# Altium project MPPT.PrjPcb
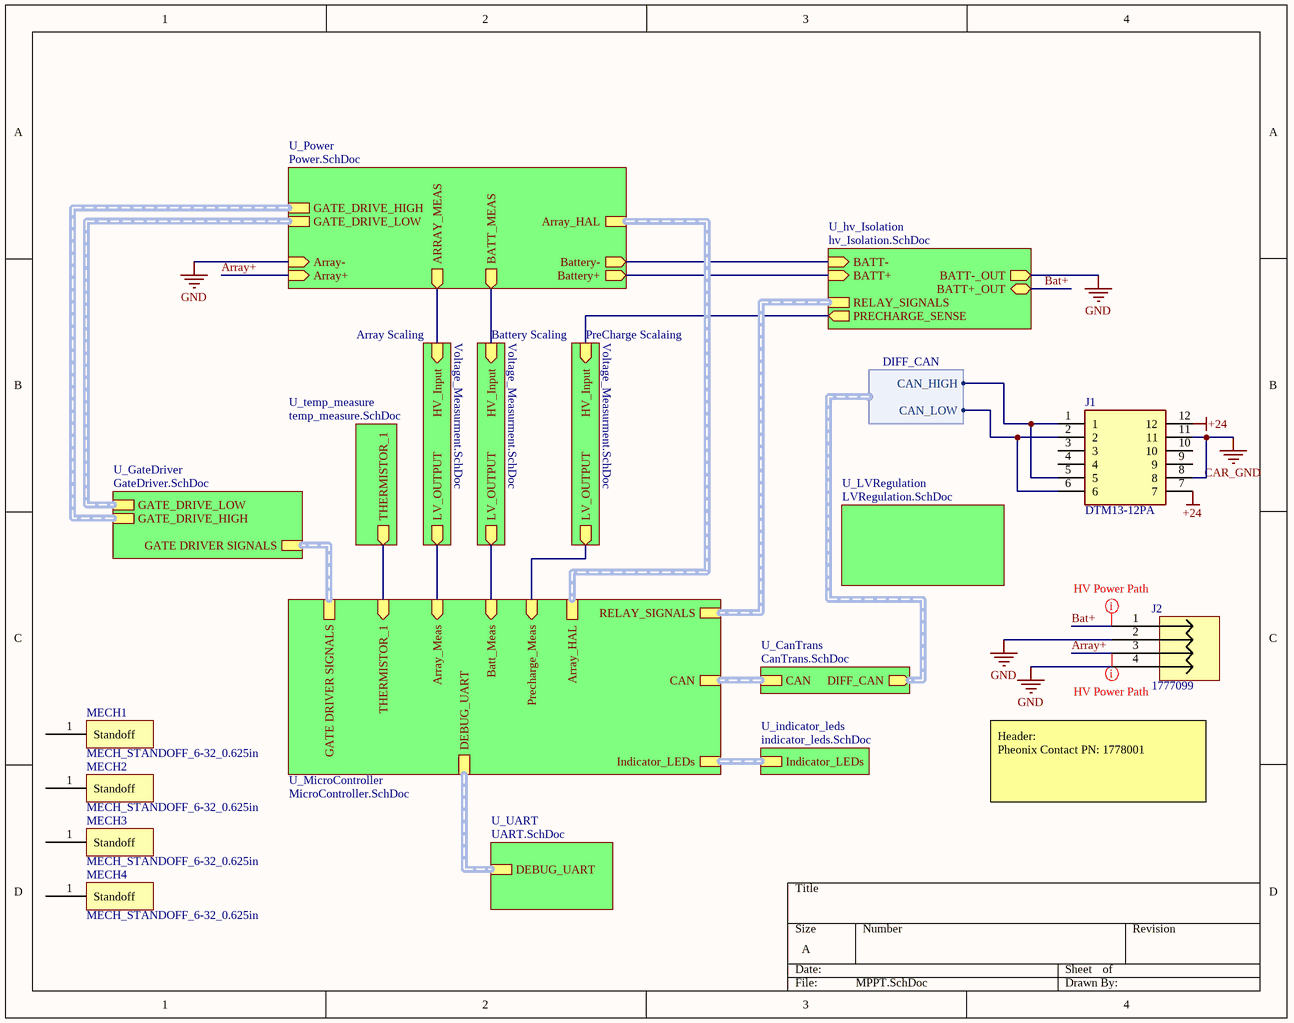
[diagram p0: MPPT.SchDoc]
12 sheets, 128 parts. Net scope: hierarchical (ports join the sheet entries above them; power ports are global).
Board file: MPPT.PcbDoc
Sheets:
  MPPT.SchDoc
    U_GateDriver = GateDriver.SchDoc
    U_Power = Power.SchDoc
    U_MicroController = MicroController.SchDoc
      U_JTAG = JTAG.SchDoc
    U_CanTrans = CanTrans.SchDoc
    Array Scaling = Voltage_Measurment.SchDoc
    Battery Scaling = Voltage_Measurment.SchDoc
    U_LVRegulation = LVRegulation.SchDoc
    U_hv_Isolation = hv_Isolation.SchDoc
    U_indicator_leds = indicator_leds.SchDoc
    U_temp_measure = temp_measure.SchDoc
    PreCharge Scalaing = Voltage_Measurment.SchDoc
    U_UART = UART.SchDoc

## Sheet MPPT.SchDoc
size A; SheetNumber: 1; SheetTotal: 12

### Parts
J1  DTM13-12PA  [TE_DTM13-12PA]
J2  1777099  [FP-1777099-MFG]
MECH1  MECH_STANDOFF_6-32_0.625in  [STANDOFF_6-32_0.625in]
MECH2  MECH_STANDOFF_6-32_0.625in  [STANDOFF_6-32_0.625in]
MECH3  MECH_STANDOFF_6-32_0.625in  [STANDOFF_6-32_0.625in]
MECH4  MECH_STANDOFF_6-32_0.625in  [STANDOFF_6-32_0.625in]

### Sub-sheets
Array Scaling = Voltage_Measurment.SchDoc: LV_OUTPUT (out), HV_Input (in)
Battery Scaling = Voltage_Measurment.SchDoc: LV_OUTPUT (out), HV_Input (in)
PreCharge Scalaing = Voltage_Measurment.SchDoc: LV_OUTPUT (out), HV_Input (in)
U_CanTrans = CanTrans.SchDoc: CAN (harness CAN), DIFF_CAN (out, harness DIFF_CAN)
U_GateDriver = GateDriver.SchDoc: GATE DRIVER SIGNALS (harness Gate Driver), GATE_DRIVE_HIGH (harness GATE_DRIVE), GATE_DRIVE_LOW (harness GATE_DRIVE)
U_hv_Isolation = hv_Isolation.SchDoc: BATT+_OUT (bidir), BATT-_OUT (out), BATT+ (in), BATT- (in), RELAY_SIGNALS, PRECHARGE_SENSE (out)
U_indicator_leds = indicator_leds.SchDoc: Indicator_LEDs (harness Indicator LEDs)
U_LVRegulation = LVRegulation.SchDoc: no entries
U_MicroController = MicroController.SchDoc: CAN (harness CAN), Batt_Meas (in), Array_Meas (in), GATE DRIVER SIGNALS (harness Gate Driver), RELAY_SIGNALS (harness RELAY SIGNALS), Indicator_LEDs, THERMISTOR_1 (in), Array_HAL, Precharge_Meas (in), DEBUG_UART (harness DEBUG_UART)
U_Power = Power.SchDoc: Array- (in), Array+ (in), Battery+ (out), Battery- (out), GATE_DRIVE_HIGH, GATE_DRIVE_LOW, BATT_MEAS (out), ARRAY_MEAS (out), Array_HAL (harness HAL_OUTPUT)
U_temp_measure = temp_measure.SchDoc: THERMISTOR_1 (out)
U_UART = UART.SchDoc: DEBUG_UART

### Harnesses
DIFF_CAN: CAN_HIGH, CAN_LOW

### Nets
+24: J1.7 J1.12
CAR_GND: J1.8 J1.11
GND: J2.2 J2.4 ; sheet U_Power/Array-, sheet U_Power/Battery-, sheet U_hv_Isolation/BATT-_OUT, sheet U_hv_Isolation/BATT-
Array+: J2.3 ; sheet U_Power/Array+
Array_Measure: sheet U_Power/ARRAY_MEAS, sheet Array Scaling/HV_Input
Bat+: J2.1 ; sheet U_hv_Isolation/BATT+_OUT
boost_output: sheet U_Power/BATT_MEAS, sheet Battery Scaling/HV_Input
CAN_N: J1.2 J1.6 ; sheet U_CanTrans/DIFF_CAN.CAN_LOW
CAN_P: J1.1 J1.5 ; sheet U_CanTrans/DIFF_CAN.CAN_HIGH
NetC35A_2: sheet U_MicroController/Array_Meas, sheet Array Scaling/LV_OUTPUT
NetC35B_2: sheet U_MicroController/Batt_Meas, sheet Battery Scaling/LV_OUTPUT
NetC35C_2: sheet U_MicroController/Precharge_Meas, sheet PreCharge Scalaing/LV_OUTPUT
NetF1_2: sheet U_Power/Battery+, sheet U_hv_Isolation/BATT+
NetJ4_2: sheet U_MicroController/THERMISTOR_1, sheet U_temp_measure/THERMISTOR_1
NetK1_4: sheet U_hv_Isolation/PRECHARGE_SENSE, sheet PreCharge Scalaing/HV_Input

Not connected (* = marked no-connect by the designer): J1 3 4 9 10; MECH1 1(Standoff); MECH2 1(Standoff); MECH3 1(Standoff); MECH4 1(Standoff)

### Buses and harness runs
harness sheet U_CanTrans/CAN = sheet U_MicroController/CAN
harness sheet U_GateDriver/GATE DRIVER SIGNALS = sheet U_MicroController/GATE DRIVER SIGNALS
harness sheet U_GateDriver/GATE_DRIVE_HIGH = sheet U_Power/GATE_DRIVE_HIGH
harness sheet U_GateDriver/GATE_DRIVE_LOW = sheet U_Power/GATE_DRIVE_LOW
harness sheet U_hv_Isolation/RELAY_SIGNALS = sheet U_MicroController/RELAY_SIGNALS
harness sheet U_indicator_leds/Indicator_LEDs = sheet U_MicroController/Indicator_LEDs
harness sheet U_MicroController/Array_HAL = sheet U_Power/Array_HAL
harness sheet U_MicroController/DEBUG_UART = sheet U_UART/DEBUG_UART

### Layout directives
net class High Current; net class HV: Array+, Bat+

### Notes on the sheet
- Header:
  Pheonix Contact PN: 1778001

### Library data of the parts
J1 = CMP-183-000000-3: 12 way DTM13 A key Receptacle with PCB mount and 90 degree molded pins. Sealable, with centerline pitch .165 inch/4 millimeters. Gray.; Gender: Male; Voltage Rating: 250V; Connector Type: COMBINATION LINE CONNECTOR; Max Current Rating: 11A; Mounting Technology: TH; Case/Package: 12-DIP; Pins: 12; RoHS Compliant: Yes
J2 = CMP-002-00150-1: Strip Terminal Block, 12A, 1 Row(s), 1 Deck(s); Connector Type: Through Hole; Voltage Rating: 320V; Gender: Male; Current Rating: 12A; Mounting Technology: Board; RoHS Compliant: Yes; Pins: 4; Case/Package: 4-SIP
MECH1-MECH4 = CMP-044-000005-2: Hex Standoff Threaded #6-32 Aluminum 0.625" (15.88mm) 5/8"; Design Item ID: MECH_STANDOFF_6-32_0.625in; Source: mech.SchLib

## Sheet GateDriver.SchDoc
size A; SheetNumber: 2; SheetTotal: 12
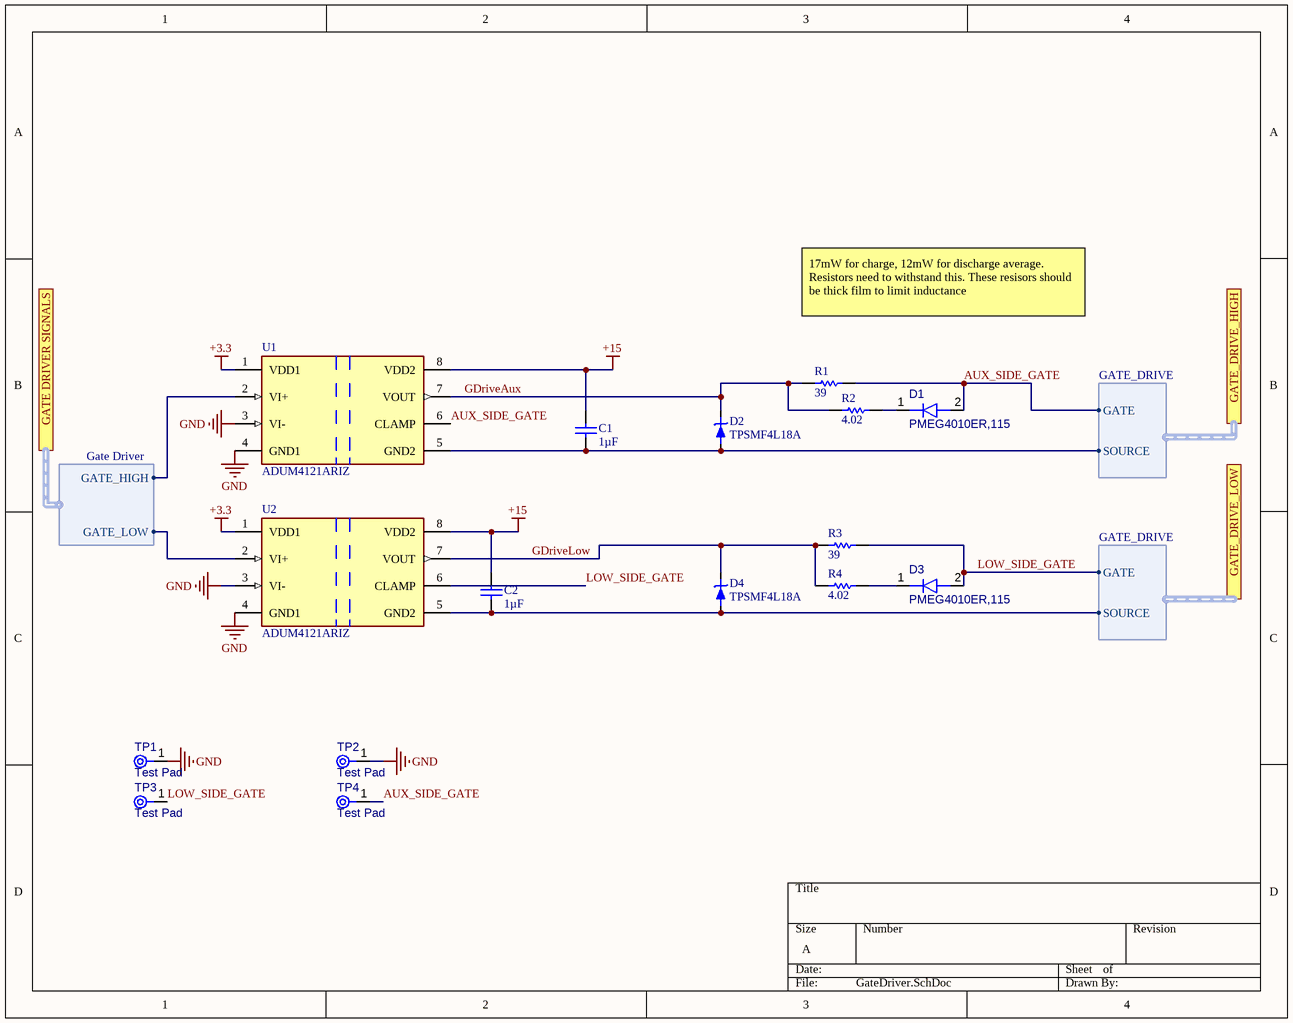
[diagram p1: GateDriver.SchDoc]

### Parts
C1  value 1µF  [0805_Capacitor]  (hidden comment: CAP 0805 1uF 50V)
C2  value 1µF  [0805_Capacitor]  (hidden comment: CAP 0805 1uF 50V)
D1  PMEG4010ER,115  [PMEG4010ER,115-Footprint-1]
D2  TPSMF4L18A  [TPSMF4L18A-Footprint-1]
D3  PMEG4010ER,115  [PMEG4010ER,115-Footprint-1]
D4  TPSMF4L18A  [TPSMF4L18A-Footprint-1]
R1  value 39  [0805_Resistor]  (hidden comment: RMCF0805JT39R0)
R2  value 4.02  [0805_Resistor]  (hidden comment: CRCW08054R02FKEA)
R3  value 39  [0805_Resistor]  (hidden comment: RMCF0805JT39R0)
R4  value 4.02  [0805_Resistor]  (hidden comment: CRCW08054R02FKEA)
TP1  Test Pad  [Test Pad-Footprint-1]  (no BOM)
TP2  Test Pad  [Test Pad-Footprint-1]  (no BOM)
TP3  Test Pad  [Test Pad-Footprint-1]  (no BOM)
TP4  Test Pad  [Test Pad-Footprint-1]  (no BOM)
U1  ADUM4121ARIZ  [FP-RI-8-1-IPC_B]
U2  ADUM4121ARIZ  [FP-RI-8-1-IPC_B]

### Ports
GATE DRIVER SIGNALS (harness Gate Driver, see MPPT[1C], MicroController[3A]), GATE_DRIVE_HIGH (harness GATE_DRIVE, see MPPT[1C], Power[4C]), GATE_DRIVE_LOW (harness GATE_DRIVE, see MPPT[1B], Power[3C])

### Harnesses
Gate Driver: GATE_HIGH, GATE_LOW
GATE_DRIVE: SOURCE, GATE

### Nets
+3.3: U1.1(VDD1) U2.1(VDD1)
+15: C1.2 C2.2 U1.8(VDD2) U2.8(VDD2)
GND: C1.1 C2.1 D2.1(Anode) D4.1(Anode) TP1.1(TP) TP2.1(TP) U1.3(VI-) U1.4(GND1) U1.5(GND2) U2.3(VI-) U2.4(GND1) U2.5(GND2) ; port GATE_DRIVE_HIGH.SOURCE, port GATE_DRIVE_LOW.SOURCE
AUX_SIDE_GATE: D1.2(A) R1.2 TP4.1(TP) U1.6(CLAMP) ; port GATE_DRIVE_HIGH.GATE
GATE_HIGH: U1.2(VI+) ; port GATE DRIVER SIGNALS.GATE_HIGH
GATE_LOW: U2.2(VI+) ; port GATE DRIVER SIGNALS.GATE_LOW
GDriveAux: D2.2(Cathode) R1.1 R2.1 U1.7(VOUT)
GDriveLow: D4.2(Cathode) R3.1 R4.1 U2.7(VOUT)
LOW_SIDE_GATE: D3.2(A) R3.2 TP3.1(TP) U2.6(CLAMP) ; port GATE_DRIVE_LOW.GATE
NetD1_1: D1.1(K) R2.2
NetD3_1: D3.1(K) R4.2

### Notes on the sheet
- 17mW for charge, 12mW for discharge average. Resistors need to withstand this. These resisors should be thick film to limit inductance

### Library data of the parts
C1 C2 = CMP-001-00098-1: Tolerance: 10%; Capacitor Type: Ceramic; Voltage Rating: 50V; Case/Package: 0805; Mounting Technology: SMT
D1 D3 = CMP-004-00045-1: Rectifier Diode, Schottky, 1 Phase, 1 Element, 1A, 40V V(RRM), Silicon; Max Surge Current: 40A; Forward Voltage: 490mV; Forward Current: 1A; Peak Inverse Voltage: 40V; Max Operating Temperature: 150°C; Case/Package: SOD-123W; RoHS Compliant: Yes; Pins: 2; Mounting Technology: SMD
D2 D4 = CMP-004-00053-2: TVS DIODE 18V 29.2V SOD123FL; Min Breakdown Voltage: 20V; Peak Pulse Power: 400W; Number of Unidirectional Channels: 1; Peak Pulse Current: 13.7A; Power Line Protection: No; Max Operating Temperature: 150°C; Packaging: Cut Tape; Min Operating Temperature: -55°C; RoHS Compliant: Yes; Reverse Standoff Voltage: 18V; Resistor Type: Zener; Mounting Technology: Surface Mount; Clamping Voltage: 29.2V
R1 R3 = Resistor     0012-1: Fixed Resistor, Metal Glaze/thick Film, 0.125W, 39ohm, 150V, 5% +/-Tol, 200ppm/Cel, Surface Mount, 0805; Power: 125mW; Mounting Technology: SMD; Min Operating Temperature: -55°C; RoHS Compliant: Yes; Tolerance: 5%; Max Operating Temperature: 155°C; Case/Package: 0805
R2 R4 = Resistor     0013-1: Fixed Resistor, Metal Glaze/thick Film, 0.125W, 4.02ohm, 150V, 1% +/-Tol, 100ppm/Cel, Surface Mount, 0805; Power: 125mW; Tolerance: 1%; Mounting Technology: SMD; Min Operating Temperature: -55°C; Case/Package: 0805; RoHS Compliant: Yes; Max Operating Temperature: 155°C
TP1-TP4 = CMP-00039-1: A circular test pad for soldering a wire to or spring tip if necessary
U1 U2 = CMP-00024-00007-1: 2A gat driver; Pins: 8; RoHS Compliant: Yes; Max Operating Temperature: 125°C; Min Operating Temperature: -40°C

## Sheet Power.SchDoc
size B; SheetNumber: 3; SheetTotal: 12; SPICEModelCacheUEHXGVAP: <root> / <DocumentId>UEHXGVAP</DocumentId> / </root>
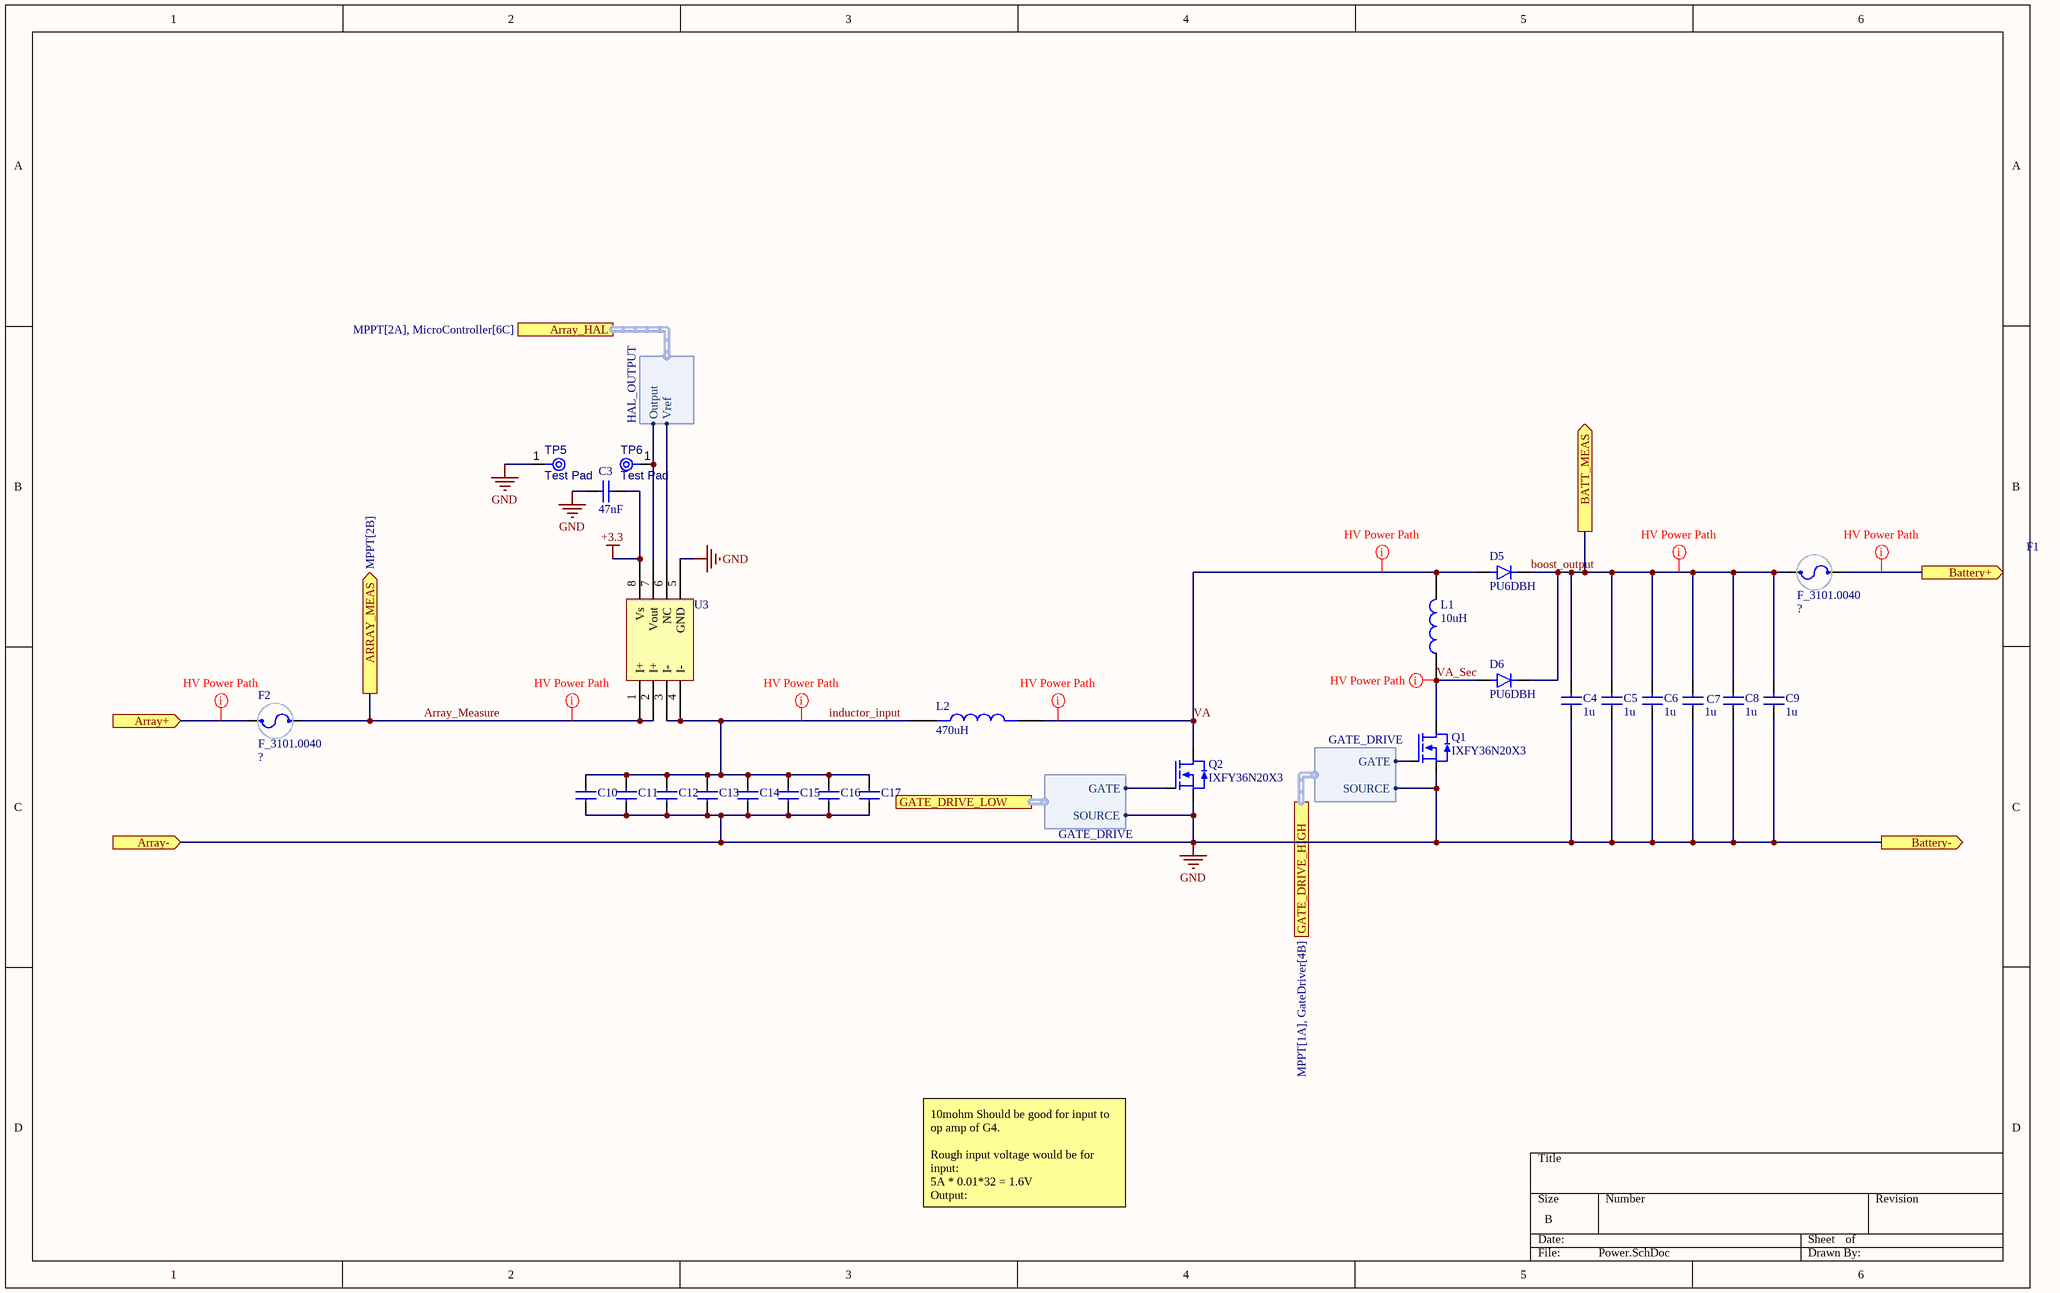
[diagram p2: Power.SchDoc]

### Parts
C3  value 47nF  [0603_CAPACITOR]  (hidden comment: C0603C473K4RECAUTO)
C4  value 1u  [1812_Capacitor]  (hidden comment: KGM43JR72D105JV)
C5  value 1u  [1812_Capacitor]  (hidden comment: KGM43JR72D105JV)
C6  value 1u  [1812_Capacitor]  (hidden comment: KGM43JR72D105JV)
C7  value 1u  [1812_Capacitor]  (hidden comment: KGM43JR72D105JV)
C8  value 1u  [1812_Capacitor]  (hidden comment: KGM43JR72D105JV)
C9  value 1u  [1812_Capacitor]  (hidden comment: KGM43JR72D105JV)
C10  HMK432BJ105MM-T  [1812_Capacitor]  (value not drawn)
C11  HMK432BJ105MM-T  [1812_Capacitor]  (value not drawn)
C12  HMK432BJ105MM-T  [1812_Capacitor]  (value not drawn)
C13  HMK432BJ105MM-T  [1812_Capacitor]  (value not drawn)
C14  HMK432BJ105MM-T  [1812_Capacitor]  (value not drawn)
C15  HMK432BJ105MM-T  [1812_Capacitor]  (value not drawn)
C16  HMK432BJ105MM-T  [1812_Capacitor]  (value not drawn)
C17  HMK432BJ105MM-T  [1812_Capacitor]  (value not drawn)
D5  PU6DBH  [DIOM4336X265N]
D6  PU6DBH  [DIOM4336X265N]
F1  F_3101.0040  [F_FPG4]
F2  F_3101.0040  [F_FPG4]
L1  value 10uH  [INDM125125X600N]  (hidden comment: DR125-100-R)
L2  value 470uH  [ATCA-08-471M-H-Footprint-1]  (hidden comment: ATCA-08-471M-H)
Q1  IXFY36N20X3  [DPAK]
Q2  IXFY36N20X3  [DPAK]
TP5  Test Pad  [Test Pad-Footprint-1]  (no BOM)
TP6  Test Pad  [Test Pad-Footprint-1]  (no BOM)
U3  TMCS1101A2UQDRQ1  [SOIC127P610X173-8N]  (value not drawn)

### Ports
Array+ (in, see MPPT[1B]), Array- (in, see MPPT[1B]), Array_HAL (harness HAL_OUTPUT, see MPPT[2A], MicroController[6C]), ARRAY_MEAS (out, see MPPT[2B]), BATT_MEAS (out, see MPPT[2B]), Battery+ (out, see MPPT[2B]), Battery- (out, see MPPT[2B]), GATE_DRIVE_HIGH (harness GATE_DRIVE, see MPPT[1A], GateDriver[4B]), GATE_DRIVE_LOW (harness GATE_DRIVE, see MPPT[1A], GateDriver[4C])

### Harnesses
GATE_DRIVE: GATE, SOURCE
HAL_OUTPUT: Vref, Output

### Nets
+3.3: C3.2 U3.8(Vs)
GND: C3.1 C4.2 C5.2 C6.2 C7.2 C8.2 C9.2 C10.2 C11.2 C12.2 C13.2 C14.2 C15.2 C16.2 C17.2 Q1.3(SOURCE) Q2.3(SOURCE) TP5.1(TP) U3.5(GND) ; port Array-, port Battery-, port GATE_DRIVE_HIGH.SOURCE, port GATE_DRIVE_LOW.SOURCE
Array+: F2.1 ; port Array+
Array_HAL_REF: U3.6(NC) ; port Array_HAL.Vref
Array_Measure: F2.2 U3.1(I+) U3.2(I+) ; port ARRAY_MEAS
AUX_SIDE_GATE: Q1.1(GATE) ; port GATE_DRIVE_HIGH.GATE
boost_output: C4.1 C5.1 C6.1 C7.1 C8.1 C9.1 D5.C(K) D6.C(K) F1.1 ; port BATT_MEAS
HAL_OUTPUT: TP6.1(TP) U3.7(Vout) ; port Array_HAL.Output
inductor_input: C10.1 C11.1 C12.1 C13.1 C14.1 C15.1 C16.1 C17.1 L2.1 U3.3(I-) U3.4(I-)
LOW_SIDE_GATE: Q2.1(GATE) ; port GATE_DRIVE_LOW.GATE
VA: D5.A L1.2 L2.2 Q2.2(DRAIN)
VA_Sec: D6.A L1.1 Q1.2(DRAIN)
NetF1_2: F1.2 ; port Battery+

### Layout directives
net class High Current; net class HV: Array+, Array_Measure, boost_output, inductor_input, NetF1_2, VA, VA_Sec

### Notes on the sheet
- 10mohm Should be good for input to op amp of G4.
  Rough input voltage would be for input:
  5A * 0.01*32 = 1.6V
  Output:
  2A * 0.01*64 = 1.28

### Library data of the parts
C3 = CMP-001-00133-1: Ceramic Capacitor, Multilayer, Ceramic, 16V, 10% +Tol, 10% -Tol, X7R, 15% TC, 0.047uF, Surface Mount, 0603; Mounting Technology: SMD; Tolerance: 10%; Capacitor Type: Ceramic; Case/Package: 0603; Voltage Rating: 16V
C4-C9 = CMP-001-00138-1: Cap Cer 1UF 200V X7R 1812; Voltage Rating: 200V
C10-C17 = CMP-001-00139-1: Medium-High Voltage Multilayer Ceramic Capacitors, 100V, 1 uF, ± 20 %, 1812, X5R/B, RoHS; RoHS Compliant: Yes
D5 D6 = CMP-201-000000-3: 25ns, 6A, 200V, Ultra Fast Recovery Rectifier; MF: Taiwan Semiconductor; Component Type: Standard; Digi-Key_Part_Number: 1801-PU6DBHTR-ND; Package: SMD-2 Taiwan Semiconductor; Design Item ID: PU6DBH; Pin Count: 2; MP: PU6DBH
F1 F2 = CMP-047-000004-2: Fuse Holder 16A 500V 1 Circuit Cartridge PCB; Manufacturer: Schurter; Voltage Rating (AC): 400V; Power Dissipation: 2.5W; Body Material: Thermoplastic; Voltage Rating (DC): 250V; Approvals: UL,CSA,VDE,IEC,SEMKO; Value: ?; Max Current: 16A; Manufacturer Part Number: 3101.0040; Min Operating Temperature: -40°C; Source: misc.SchLib; Design Item ID: F_3101.0040; Max Operating Temperature: 85°C
L1 = CMP-006-00027-1: Ind Power Shielded Wirewound 10uH 20% 100KHz Ferrite 5.35A T/R; DC Resistance (DCR): 18.9mR; Max DC Current: 7.17A; Inductor Type: POWER INDUCTOR; Mounting Technology: Surface Mount; Width: 0.492inch; Max Current Rating: 5.35A; Length: 12.5mm; Termination: SMD/SMT; Core Material: Ferrite; Weight: 0.144oz; Series: DR; DC Current: 5.35A; Tolerance: 20%; Test Frequency: 100kHz; Case/Package: Nonstandard; Depth: 12.5mm; RMS Current (Irms): 5.35A; Package Quantity: 600; Current Rating: 5.35A; Packaging: Tape and Reel; Saturation Current: 7.17A; Inductance Tolerance: 20%; Military Standard: Not; Height - Seated (Max): 0.236inch; Self Resonant Frequency: 100kHz; Height: 6mm; RoHS Compliant: Yes; Max Operating Temperature: 125°C; Shielding: Shielded; Min Operating Temperature: -40°C; Pins: 2; Reach SVHC Compliant: No; Radiation Hardening: No
L2 = CMP-006-00025-8: Coustom wound inductor using 79617A7 core; Tolerance: 20%; Max Current Rating: 11A; Min Operating Temperature: 105°C; Max Operating Temperature: -40°C; Pins: 2; Mounting Technology: TH; RoHS Compliant: Yes; Case/Package: torodial; Current Rating: 11A
Q1 Q2 = CMP-013-00046-1: X3-Class Series - 150V - 300V N-Channel Ultra Junction Power MOSFETs with HiPerFET™ Options, TO-252, RoHS; Input Capacitance: 1.425nF; Power: 176W; Rds On Max: 45mR; Drain to Source Voltage (Vdss): 200V; Continuous Drain Current (ID): 36A; Series: HiPerFET™; Packaging: Rail/Tube; Case/Package: TO-252AA; Max Operating Temperature: 150°C; Mounting Technology: Surface Mount; Min Operating Temperature: -55°C; RoHS Compliant: No
TP5 TP6 = CMP-00039-1: as TP1 on sheet GateDriver
U3 = CMP-010-00029-1: Automotive, precision isolated current sensor with internal reference 8-SOIC -40 to 125; Max Supply Voltage: 5.5V; Min Supply Voltage: 3; Sensor Type: Hall; Nominal Supply Current: 26mA; Nominal Supply Voltage: 3.3V; Max Operating Temperature: 125°C; Min Operating Temperature: -40°C; Pins: 8; Case/Package: 8-SOIC; Mounting Technology: SMD; RoHS Compliant: Yes

## Sheet MicroController.SchDoc
size B; SheetNumber: 4; SheetTotal: 12
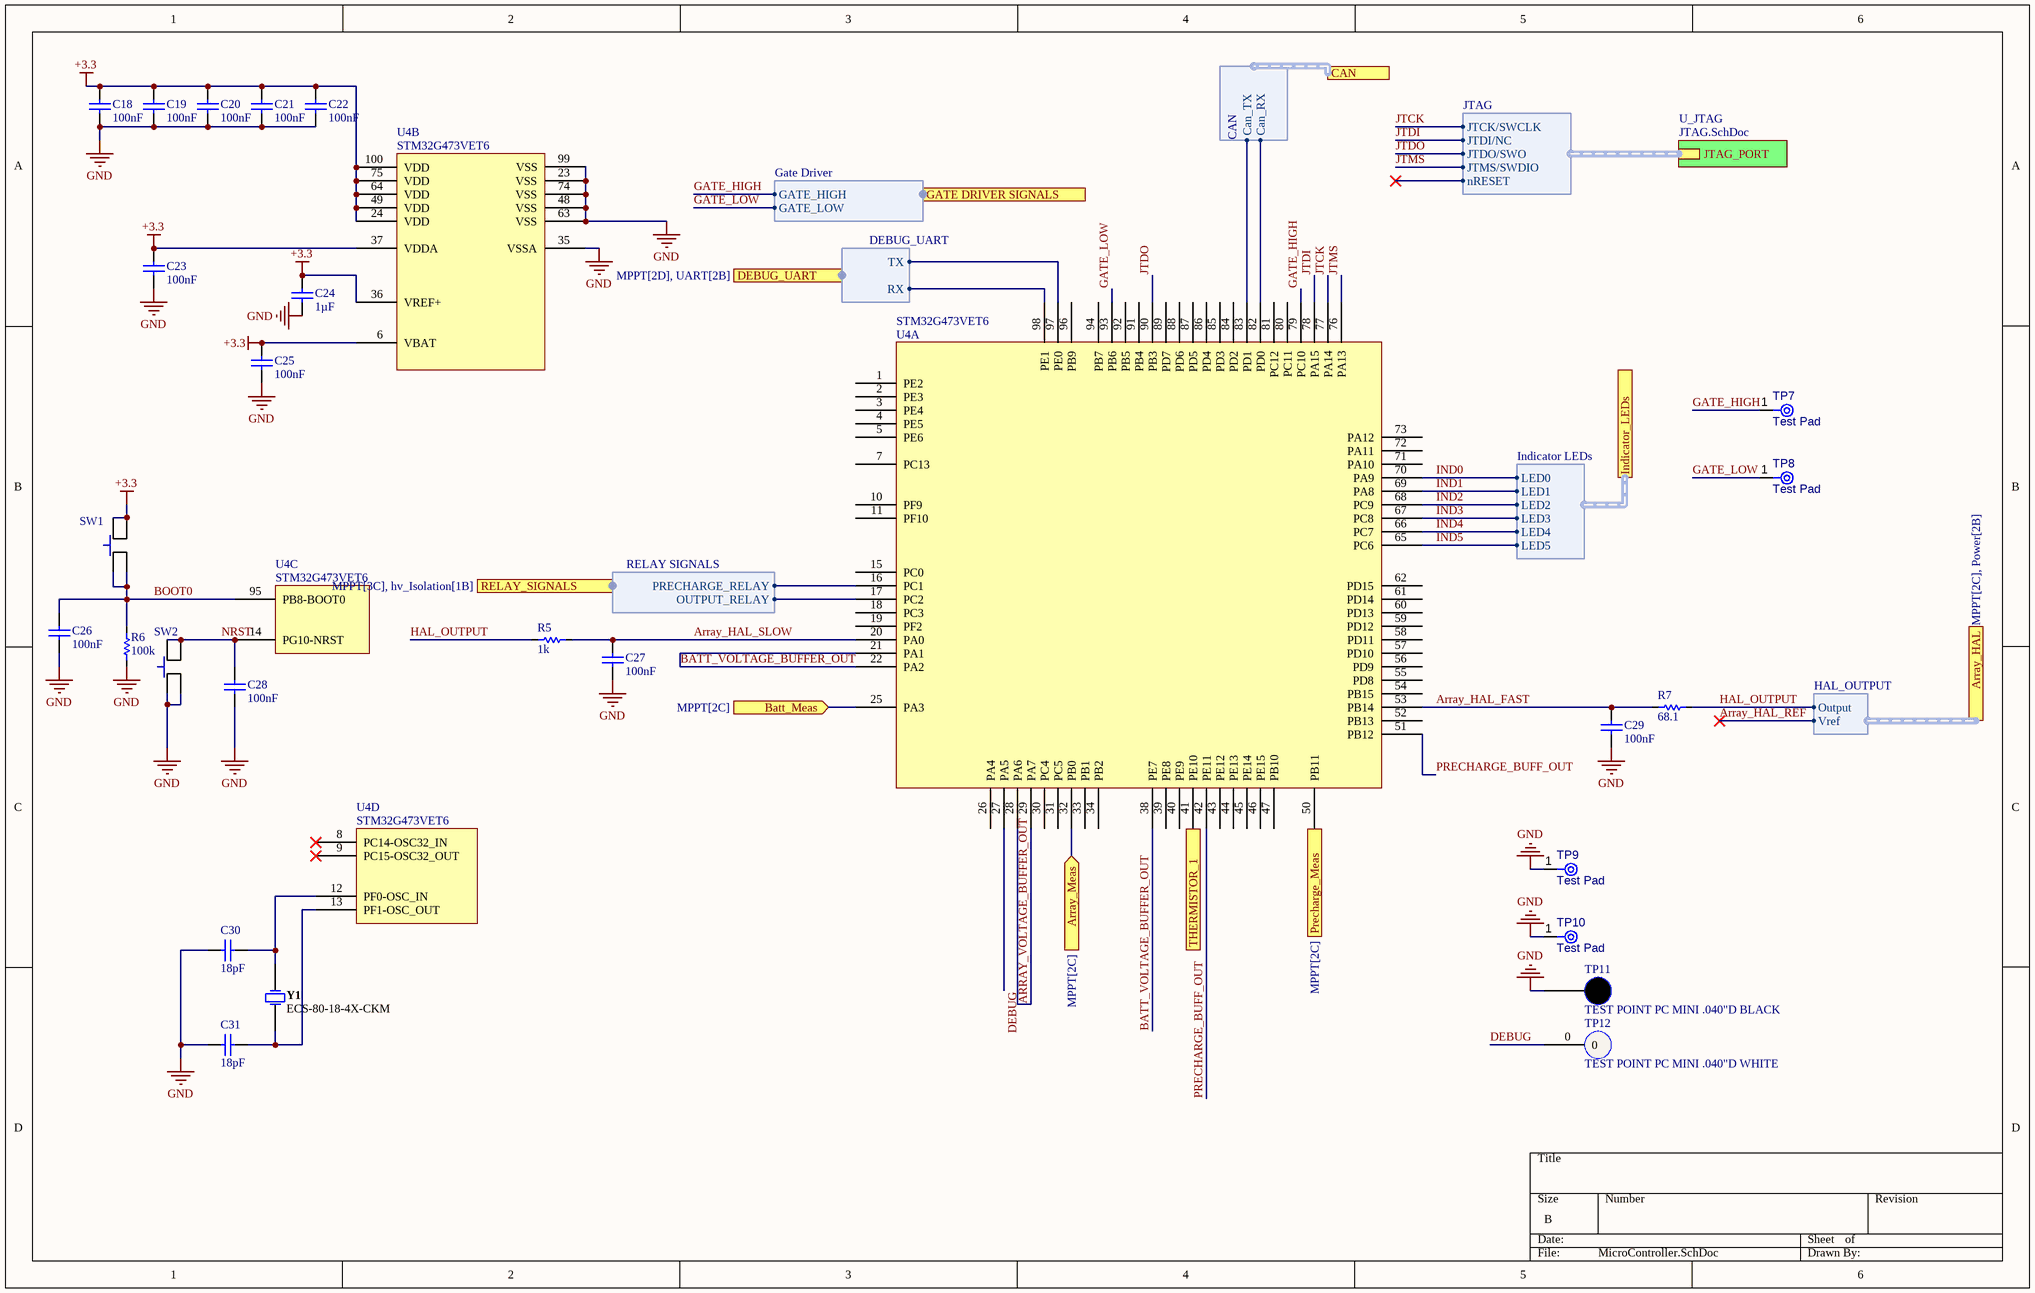
[diagram p3: MicroController.SchDoc]

### Parts
C18  value 100nF  [CAPC1608X90X40ML10T20]  (hidden comment: Capacitor 0.1uF +/-10% 50 V 0603)
C19  value 100nF  [CAPC1608X90X40ML10T20]  (hidden comment: Capacitor 0.1uF +/-10% 50 V 0603)
C20  value 100nF  [CAPC1608X90X40ML10T20]  (hidden comment: Capacitor 0.1uF +/-10% 50 V 0603)
C21  value 100nF  [CAPC1608X90X40ML10T20]  (hidden comment: Capacitor 0.1uF +/-10% 50 V 0603)
C22  value 100nF  [CAPC1608X90X40ML10T20]  (hidden comment: Capacitor 0.1uF +/-10% 50 V 0603)
C23  value 100nF  [CAPC1608X90X40ML10T20]  (hidden comment: Capacitor 0.1uF +/-10% 50 V 0603)
C24  value 1µF  [0805_Capacitor]  (hidden comment: CAP 0805 1uF 50V)
C25  value 100nF  [CAPC1608X90X40ML10T20]  (hidden comment: Capacitor 0.1uF +/-10% 50 V 0603)
C26  value 100nF  [CAPC1608X90X40ML10T20]  (hidden comment: Capacitor 0.1uF +/-10% 50 V 0603)
C27  value 100nF  [CAPC1608X90X40ML10T20]  (hidden comment: Capacitor 0.1uF +/-10% 50 V 0603)
C28  value 100nF  [CAPC1608X90X40ML10T20]  (hidden comment: Capacitor 0.1uF +/-10% 50 V 0603)
C29  value 100nF  [CAPC1608X90X40ML10T20]  (hidden comment: Capacitor 0.1uF +/-10% 50 V 0603)
C30  value 18pF  [0603_CAPACITOR]  (hidden comment: Capacitor 18pF 0603 50V 10%)
C31  value 18pF  [0603_CAPACITOR]  (hidden comment: Capacitor 18pF 0603 50V 10%)
R5  value 1k  [0603_RESISTOR]  (hidden comment: Res 0603 1K ohm 1%)
R6  value 100k  [0603_RESISTOR]  (hidden comment: Res 0603 100K ohm 1%)
R7  value 68.1  [0603_RESISTOR]  (hidden comment: Res 0603 68.1 ohm 1%)
SW1  SW_TACT_SWITCH_6x6  [TACT_SWITCH_6x6_J-LEAD]  (value not drawn)
SW2  SW_TACT_SWITCH_6x6  [TACT_SWITCH_6x6_J-LEAD]  (value not drawn)
TP7  Test Pad  [Test Pad-Footprint-1]  (no BOM)
TP8  Test Pad  [Test Pad-Footprint-1]  (no BOM)
TP9  Test Pad  [Test Pad-Footprint-1]  (no BOM)
TP10  Test Pad  [Test Pad-Footprint-1]  (no BOM)
TP11  TEST POINT PC MINI .040"D BLACK  [TEST POINT 0.040" BLACK]
TP12  TEST POINT PC MINI .040"D WHITE  [TEST POINT 0.040" WHITE]
U4  STM32G473VET6  [TSQFP50P1600X1600X160-100N]  (parts A,B,C,D of 4)
Y1  ECS-80-18-4X-CKM  [ECS-80-18-4X-CKM-Footprint-1]

### Sub-sheets
U_JTAG = JTAG.SchDoc: JTAG_PORT (harness JTAG)

### Ports
Array_HAL (harness HAL_OUTPUT, see MPPT[2C], Power[2B]), Array_Meas (in, see MPPT[2C]), Batt_Meas (in, see MPPT[2C]), CAN (harness CAN, see MPPT[3C], CanTrans[1B]), DEBUG_UART (harness DEBUG_UART, see MPPT[2D], UART[2B]), GATE DRIVER SIGNALS (harness Gate Driver, see MPPT[2C], GateDriver[1B]), Indicator_LEDs (harness Indicator LEDs, see MPPT[3C], indicator_leds[1B]), Precharge_Meas (in, see MPPT[2C]), RELAY_SIGNALS (harness RELAY SIGNALS, see MPPT[3C], hv_Isolation[1B]), THERMISTOR_1 (in, see MPPT[2C], temp_measure[1A])

### Harnesses
CAN: Can_RX, Can_TX
JTAG: JTCK/SWCLK, JTDI/NC, JTDO/SWO, JTMS/SWDIO, nRESET
Gate Driver: GATE_HIGH, GATE_LOW
RELAY SIGNALS: PRECHARGE_RELAY, OUTPUT_RELAY
Indicator LEDs: LED0, LED1, LED2, LED3, LED4, LED5
HAL_OUTPUT: Output, Vref
DEBUG_UART: TX, RX

### Nets
+3.3: C18.2 C19.2 C20.2 C21.2 C22.2 C23.2 C24.1 C25.2 SW1.2 SW1.3 U4.6(VBAT) U4.24(VDD) U4.36(VREF+) U4.37(VDDA) U4.49(VDD) U4.64(VDD) U4.75(VDD) U4.100(VDD)
GND: C18.1 C19.1 C20.1 C21.1 C22.1 C23.1 C24.2 C25.1 C26.1 C27.1 C28.1 C29.1 C30.1 C31.1 R6.1 SW2.1 SW2.4 TP9.1(TP) TP10.1(TP) TP11.0 U4.23(VSS) U4.35(VSSA) U4.48(VSS) U4.63(VSS) U4.74(VSS) U4.99(VSS)
Array_HAL_FAST: C29.2 R7.2 U4.53(PB14)
Array_HAL_SLOW: C27.2 R5.2 U4.20(PA0)
ARRAY_VOLTAGE_BUFFER_OUT: U4.28(PA6) U4.29(PA7)
BATT_VOLTAGE_BUFFER_OUT: U4.21(PA1) U4.22(PA2) U4.38(PE7)
BOOT0: C26.2 R6.2 SW1.1 SW1.4 U4.95(PB8-BOOT0)
CAN_RX: U4.82(PD0) ; port CAN.Can_RX
CAN_TX: U4.83(PD1) ; port CAN.Can_TX
DEBUG: TP12.0 U4.27(PA5)
GATE_HIGH: TP7.1(TP) U4.79(PC10) ; port GATE DRIVER SIGNALS.GATE_HIGH
GATE_LOW: TP8.1(TP) U4.93(PB6) ; port GATE DRIVER SIGNALS.GATE_LOW
HAL_OUTPUT: R5.1 R7.1 ; port Array_HAL.Output
IND0: U4.70(PA9) ; port Indicator_LEDs.LED0
IND1: U4.69(PA8) ; port Indicator_LEDs.LED1
IND2: U4.68(PC9) ; port Indicator_LEDs.LED2
IND3: U4.67(PC8) ; port Indicator_LEDs.LED3
IND4: U4.66(PC7) ; port Indicator_LEDs.LED4
IND5: U4.65(PC6) ; port Indicator_LEDs.LED5
JTCK: U4.77(PA14) ; sheet U_JTAG/JTAG_PORT.JTCK/SWCLK
JTDI: U4.78(PA15) ; sheet U_JTAG/JTAG_PORT.JTDI/NC
JTDO: U4.90(PB3) ; sheet U_JTAG/JTAG_PORT.JTDO/SWO
JTMS: U4.76(PA13) ; sheet U_JTAG/JTAG_PORT.JTMS/SWDIO
NRST: C28.2 SW2.2 SW2.3 U4.14(PG10-NRST)
PRECHARGE_BUFF_OUT: U4.42(PE11) U4.51(PB12)
NetC30_2: C30.2 U4.12(PF0-OSC_IN) Y1.2
NetC31_2: C31.2 U4.13(PF1-OSC_OUT) Y1.1
NetC35A_2: U4.32(PB0) ; port Array_Meas
NetC35B_2: U4.25(PA3) ; port Batt_Meas
NetC35C_2: U4.50(PB11) ; port Precharge_Meas
NetJ4_2: U4.41(PE10) ; port THERMISTOR_1
NetJ5_1: U4.97(PE0) ; port DEBUG_UART.TX
NetJ5_2: U4.98(PE1) ; port DEBUG_UART.RX
NetR13_1: U4.16(PC1) ; port RELAY_SIGNALS.PRECHARGE_RELAY
NetR15_1: U4.17(PC2) ; port RELAY_SIGNALS.OUTPUT_RELAY

Not connected (* = marked no-connect by the designer): U4 1(PE2) 2(PE3) 3(PE4) 4(PE5) 5(PE6) 7(PC13) 8(PC14-OSC32_IN)* 9(PC15-OSC32_OUT)* 10(PF9) 11(PF10) 15(PC0) 18(PC3) 19(PF2) 26(PA4) 30(PC4) 31(PC5) 33(PB1) 34(PB2) 39(PE8) 40(PE9) 43(PE12) 44(PE13) 45(PE14) 46(PE15) 47(PB10) 52(PB13) 54(PB15) 55(PD8) 56(PD9) 57(PD10) 58(PD11) 59(PD12) 60(PD13) 61(PD14) 62(PD15) 71(PA10) 72(PA11) 73(PA12) 80(PC11) 81(PC12) 84(PD2) 85(PD3) 86(PD4) 87(PD5) 88(PD6) 89(PD7) 91(PB4) 92(PB5) 94(PB7) 96(PB9)

### Library data of the parts
C18-C23 C25-C29 = CMP-001-00017-10: Chip Capacitor, 0.1uF, +/- 10%, 50 V, 0603 (1608 Metric); Capacitor Type: Ceramic; Voltage Rating: 50V; Min Operating Temperature: -55°C; Max Operating Temperature: 125°C; Mounting Technology: SMT; Tolerance: 10%; Pins: 2; Case/Package: 0603
C24 = CMP-001-00098-1: Tolerance: 10%; Capacitor Type: Ceramic; Voltage Rating: 50V; Case/Package: 0805; Mounting Technology: SMT
C30 C31 = CMP-001-00108-2: Capacitor 18pF ceramic 0603 10% 50V; Voltage Rating: 50V; Tolerance: 10%; Case/Package: 0603; Mounting Technology: SM; Capacitor Type: Ceramic
R5 = CMP-058-000005-5: RES 1K OHM 1/16W 1% 0603 SMD; Power: 62.5mW; Pins: 2; Tolerance: 1%; Mounting Technology: SMD; Case/Package: 0603
R6 = CMP-058-000032-7: RES 100K OHM 1/16W 1% 0603 SMD; Power: 62.5mW; Pins: 2; Case/Package: 0603; Mounting Technology: SMD; Tolerance: 1%
R7 = CMP-058-000037-11: RES 68.1 OHM 1/16W 1% 0603 SMD; Power: 62.5mW; Tolerance: 1%; Case/Package: 0603; Mounting Technology: SMD
SW1 SW2 = CMP-050-000002-1: SWITCH TACT 6MM BLACK 160GF; SVP Creator: Spencer Berglund; Design Item ID: SW_TACT_SWITCH_6x6; Source: misc.SchLib; Package: 6mm x 6mm
TP7-TP10 = CMP-00039-1: as TP1 on sheet GateDriver
TP11 = CMP-054-000001-1: Design Item ID: TEST POINT PC MINI .040"D BLACK; Source: misc.SchLib
TP12 = CMP-113-000002-1: Design Item ID: TEST POINT PC MINI .040"D WHITE; Source: Common.SchLib
U4 = CMP-00014-7: RISC Microcontroller, 32-Bit, 170MHz; Nominal Supply Voltage: 3.3V; RAM Size: 128; Frequency: 170Hz; Interface: JTAG; Pins: 100; RoHS Compliant: Yes; Case/Package: LQFP100; Mounting Technology: SMD
Y1 = CMP-003-00032-1: Crystal 8MHz ±10ppm (Tol) ±10ppm (Stability) 18pF FUND 80Ohm 2-Pin HC-49/USX Thru-Hole Bulk; ESR: 80; Pins: 2; Frequency: 8MHz; Case/Package: HC-49/USX; Load Capacitance: 18pF; Mounting Technology: TH

## Sheet JTAG.SchDoc
size A; SheetNumber: 5; SheetTotal: 12
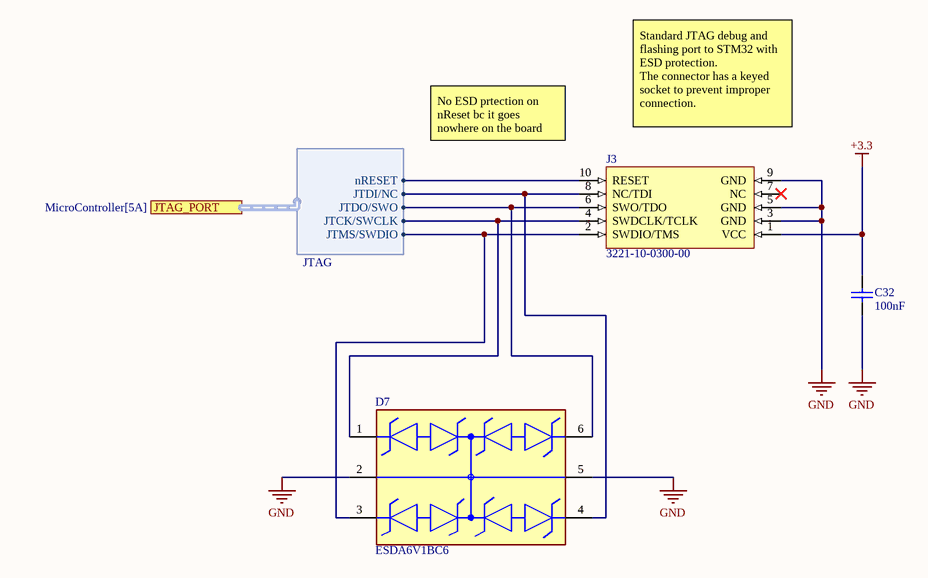
[diagram p4: JTAG.SchDoc]

### Parts
C32  value 100nF  [CAPC1608X90X40ML10T20]  (hidden comment: Capacitor 0.1uF +/-10% 50 V 0603)
D7  ESDA6V1BC6  [FP-SOT23-6L-IPC_A]
J3  3221-10-0300-00  [3221-10-0300-00-Footprint-1]

### Ports
JTAG_PORT (harness JTAG, see MicroController[5A])

### Harnesses
JTAG: JTMS/SWDIO, JTCK/SWCLK, JTDO/SWO, JTDI/NC, nRESET

### Nets
+3.3: C32.2 J3.1(VCC)
GND: C32.1 D7.2 D7.5 J3.3(GND) J3.5(GND) J3.9(GND)
JTCK: D7.1 J3.4(SWDCLK/TCLK) ; port JTAG_PORT.JTCK/SWCLK
JTDI: D7.4 J3.8(NC/TDI) ; port JTAG_PORT.JTDI/NC
JTDO: D7.6 J3.6(SWO/TDO) ; port JTAG_PORT.JTDO/SWO
JTMS: D7.3 J3.2(SWDIO/TMS) ; port JTAG_PORT.JTMS/SWDIO
NetJ3_10: J3.10(RESET) ; port JTAG_PORT.nRESET

Not connected (* = marked no-connect by the designer): J3 7(NC)*

### Notes on the sheet
- Standard JTAG debug and flashing port to STM32 with ESD protection.
  The connector has a keyed socket to prevent improper connection.
- No ESD prtection on nReset bc it goes nowhere on the board

### Library data of the parts
C32 = CMP-001-00017-10: as C18 on sheet MicroController; Min Operating Temperature: -55°C; Max Operating Temperature: 125°C; Mounting Technology: SMT; Tolerance: 10%; Pins: 2; Case/Package: 0603
D7 = CMP-004-00048-1: Trans Voltage Suppressor Diode, 80W, 5V V(RWM), Bidirectional, 4 Element, Silicon; Max Surge Current: 8A; Peak Inverse Voltage: 8V; Max Operating Temperature: 150°C; Pins: 6; Mounting Technology: SMD; RoHS Compliant: Yes; Case/Package: SOT23-6L
J3 = CMP-002-00077-1: JTAG STLINK CONN HEADER SMD 10POS 1.27MM

## Sheet CanTrans.SchDoc
size A; SheetNumber: 6; SheetTotal: 12
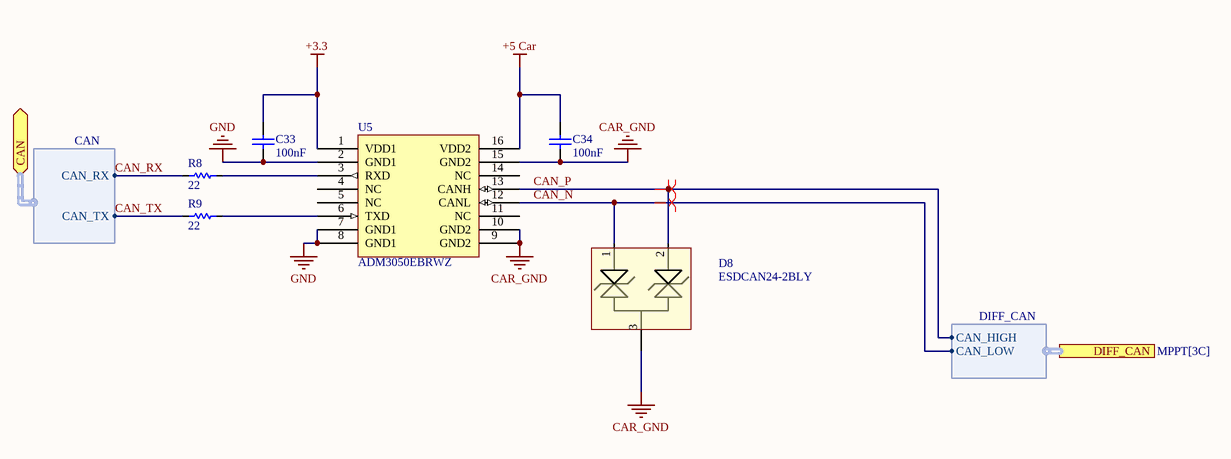
[diagram p5: CanTrans.SchDoc]

### Parts
C33  value 100nF  [CAPC1608X90X40ML10T20]  (hidden comment: Capacitor 0.1uF +/-10% 50 V 0603)
C34  value 100nF  [CAPC1608X90X40ML10T20]  (hidden comment: Capacitor 0.1uF +/-10% 50 V 0603)
D8  ESDCAN24-2BLY  [SOT23-3]
R8  value 22  [0603_RESISTOR]  (hidden comment: Res 0603 22.1 ohm 1%)
R9  value 22  [0603_RESISTOR]  (hidden comment: Res 0603 22.1 ohm 1%)
U5  ADM3050EBRWZ  [SOIC127P1030X265-16N]

### Ports
CAN (bidir, harness CAN, see MPPT[3C], MicroController[4A]), DIFF_CAN (harness DIFF_CAN, see MPPT[3C])

### Harnesses
CAN: CAN_TX, CAN_RX
DIFF_CAN: CAN_HIGH, CAN_LOW

### Nets
+3.3: C33.2 U5.1(VDD1)
+5 Car: C34.1 U5.16(VDD2)
CAR_GND: C34.2 D8.3 U5.9(GND2) U5.10(GND2) U5.15(GND2)
GND: C33.1 U5.2(GND1) U5.7(GND1) U5.8(GND1)
CAN_N: D8.1 U5.12(CANL) ; port DIFF_CAN.CAN_LOW
CAN_P: D8.2 U5.13(CANH) ; port DIFF_CAN.CAN_HIGH
CAN_RX: R8.1 ; port CAN.CAN_RX
CAN_TX: R9.1 ; port CAN.CAN_TX
NetR8_2: R8.2 U5.3(RXD)
NetR9_2: R9.2 U5.6(TXD)

Not connected (* = marked no-connect by the designer): U5 4(NC) 5(NC) 11(NC) 14(NC)

### Layout directives
differential pair: CAN_N, CAN_P

### Library data of the parts
C33 C34 = CMP-001-00017-10: Chip Capacitor, 0.1uF, +/- 10%, 50 V, 0603 (1608 Metric); Voltage Rating: 50V; Capacitor Type: Ceramic; Max Operating Temperature: 125°C; Case/Package: 0603; Mounting Technology: SMT; Pins: 2; Tolerance: 10%; Min Operating Temperature: -55°C
D8 = CMP-004-00032-2: ESD Suppressor TVS 24V Automotive 3-Pin SOT-23 T/R; Max Power Dissipation: 230W; Number of Channels: 2; Capacitance: 30pF; Leakage Current: 100nA; Polarity: Bidirectional; ESD Protection: Yes; Clamping Voltage: 43V; Diode Type: ZENER; Breakdown Voltage: 27V; Peak Pulse Current: 5.5A; Min Breakdown Voltage: 26.2V; Element Configuration: Dual; Power Line Protection: No; Height: 1.4mm; Mount: Surface Mount; Termination: SMD/SMT; Number of Pins: 3; Resistor Type: Zener; RoHS Compliant: Yes; Number of Bidirectional Channels: 2; Working Voltage: 24V; Min Operating Temperature: -40°C; REACH SVHC: No SVHC; Width: 1.75mm; Reverse Standoff Voltage: 24V; Case/Package: SOT-23; Series: Automotive, AEC-Q101, ESDCAY, TRANSIL™; Radiation Hardening: No; Package Quantity: 1; Direction: Bidirectional; Peak Pulse Power: 230W; Max Reverse Leakage Current: 100nA; Max Operating Temperature: 150°C; Length: 2.9mm; Depth: 1.3mm; Packaging: Tape and Reel; Lead Free: Lead Free
R8 R9 = CMP-058-000007-6: RES 22 OHM 1/16W 1% 0603 SMD; Power: 62.5mW; Tolerance: 1%; Case/Package: 0603; Mounting Technology: SMD; Pins: 2
U5 = CMP-015-00019-2: MIL-STD-1553 Data Bus Transceiver, PDSO16. Isolated CANFD transceiver; Nominal Supply Voltage: 5V; Max Supply Voltage: 5.5V; Min Supply Voltage: 1.7V; Case/Package: SOIC-16; Mounting Technology: SMD; RoHS Compliant: Yes; Max Operating Temperature: 125°C; Pins: 16; Min Operating Temperature: -45°C

## Sheet Voltage_Measurment.SchDoc
size A; SheetNumber: 7; SheetTotal: 12
Used 3 times, as channels Array Scaling, Battery Scaling, PreCharge Scalaing. Parts and nets are listed once, with the designators drawn on the sheet.
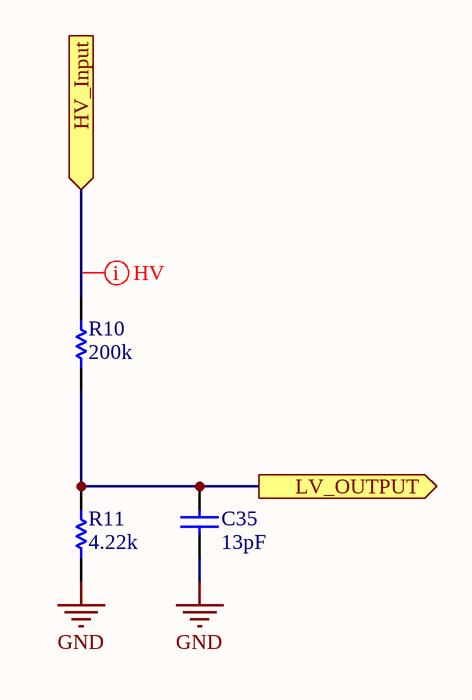
[diagram p6: Voltage_Measurment.SchDoc]

### Parts
C35  value 13pF  [0603_CAPACITOR]  (hidden comment: Capacitor 13pF 0603 5% 50V)
R10  value 200k  [1206_RESISTOR]  (hidden comment: Resistor 200K 1206 1% 1/4W)
R11  value 4.22k  [0603_RESISTOR]  (hidden comment: Resistor 4.22k 0603 0.1W 1%)

### Ports
HV_Input (in, see MPPT[2B]), LV_OUTPUT (out, see MPPT[2C])

### Nets
GND: C35.1 R11.1
HV_Input: R10.2 ; port HV_Input
LV_OUTPUT: C35.2 R10.1 R11.2 ; port LV_OUTPUT

### Channels
Array Scaling: designators end in A; ports HV_Input=Array_Measure LV_OUTPUT=NetC35A_2
Battery Scaling: designators end in B; ports HV_Input=boost_output LV_OUTPUT=NetC35B_2
PreCharge Scalaing: designators end in C; ports HV_Input=NetK1_4 LV_OUTPUT=NetC35C_2

### Layout directives
net class HV: Array_Measure

### Library data of the parts
C35 = CMP-001-00121-1: Ceramic Capacitor, Multilayer, Ceramic, 50V, 5% +Tol, 5% -Tol, C0G, 30ppm/Cel TC, 0.000013uF, Surface Mount, 0603; Tolerance: 5%; Min Operating Temperature: -55°C; Max Operating Temperature: 125°C; Mounting Technology: SMD; Case/Package: 0603; Voltage Rating: 50V; Capacitor Type: Ceramic
R10 = Resistor     0007-1: Power: 250mW; Max Operating Temperature: 155°C; Tolerance: 1%; Min Operating Temperature: -55°C; Mounting Technology: SMD; RoHS Compliant: Yes; Case/Package: 1206
R11 = Resistor     0006-1: Fixed Resistor, Metal Glaze/thick Film, 0.1W, 4220ohm, 75V, 1% +/-Tol, 100ppm/Cel, Surface Mount, 0603; Power: 100mW; Case/Package: 0603; Tolerance: 1%; RoHS Compliant: Yes; Mounting Technology: SMD; Min Operating Temperature: -55°C; Max Operating Temperature: 155°C

## Sheet LVRegulation.SchDoc
size A; SheetNumber: 8; SheetTotal: 12; SPICEModelCacheTGRHLAKJ: <root> / <DocumentId>TGRHLAKJ</DocumentId> / </root>
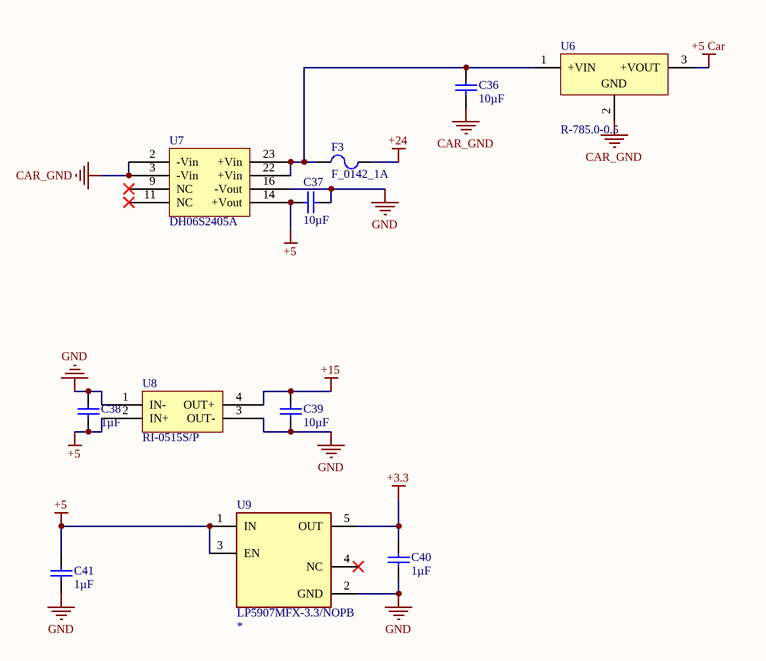
[diagram p7: LVRegulation.SchDoc]

### Parts
C36  value 10µF  [1210_Capacitor]  (hidden comment: Cap Cerem 10uF 10% 50V)
C37  value 10µF  [1210_Capacitor]  (hidden comment: Cap Cerem 10uF 10% 50V)
C38  value 1µF  [0805_Capacitor]  (hidden comment: CAP 0805 1uF 50V)
C39  value 10µF  [1210_Capacitor]  (hidden comment: Cap Cerem 10uF 10% 50V)
C40  value 1µF  [0805_Capacitor]  (hidden comment: CAP 0805 1uF 50V)
C41  value 1µF  [0805_Capacitor]  (hidden comment: CAP 0805 1uF 50V)
F3  F_0142_1A  [0154_FUSE_HOLDER]
U6  R-785.0-0.5  [REPO-R-78XX-3_V]
U7  DH06S2405A  [DH06S2405A-Footprint-1]
U8  RI-0515S/P  [ROE-2405S-Footprint-1]
U9  LP5907MFX-3.3/NOPB  [FP-DBV0005A-MFG]

### Nets
+3.3: C40.2 U9.5(OUT)
+5: C37.1 C38.1 C41.2 U7.14(+Vout) U8.2(IN+) U9.1(IN) U9.3(EN)
+5 Car: U6.3(+VOUT)
+15: C39.2 U8.4(OUT+)
+24: F3.2
CAR_GND: C36.1 U6.2(GND) U7.2(-Vin) U7.3(-Vin)
GND: C37.2 C38.2 C39.1 C40.1 C41.1 U7.16(-Vout) U8.1(IN-) U8.3(OUT-) U9.2(GND)
NetC36_2: C36.2 F3.1 U6.1(+VIN) U7.22(+Vin) U7.23(+Vin)

Not connected (* = marked no-connect by the designer): U7 9(NC)* 11(NC)*; U9 4(NC)*

### Library data of the parts
C36 C37 C39 = CMP-001-00101-3: Capacitor Type: Ceramic; Mounting Technology: SM; Tolerance: 10%; Voltage Rating: 50V; Case/Package: 1210
C38 C40 C41 = CMP-001-00098-1: Tolerance: 10%; Capacitor Type: Ceramic; Voltage Rating: 50V; Case/Package: 0805; Mounting Technology: SMT
F3 = CMP-105-000000-1: SVP Creator: Spencer Berglund; Current: 1A; Design Item ID: F_0142_1A; Source: Common.SchLib
U6 = CMP-019-00059-1: DC-DC Regulated Power Supply Module, 1 Output, 2.5W, Hybrid; Output Current: 500mA; Min Supply Voltage: 6.5V; Output Voltage: 5V; Max Supply Voltage: 32V; RoHS Compliant: Yes; Pins: 3; Mounting Technology: TH; Max Operating Temperature: 71°C; Min Operating Temperature: -40°C; Case/Package: SIP-3
U7 = CMP-019-00061-4: DC/DC converter 18...75 VDC 5 VDC, DJ06S4805A, Delta-Electronics; Output Voltage: 5V; Max Supply Voltage: 36V; Min Supply Voltage: 18V; Output Current: 1.2A; RoHS Compliant: Yes; Min Operating Temperature: -40°C; Max Operating Temperature: 85°C; Mounting Technology: TH; Case/Package: DIP; Pins: 8
U8 = CMP-019-00064-1: DC-DC Unregulated Power Supply Module, 1 Output, 2W, Hybrid; Min Supply Voltage: 4.5V; Max Supply Voltage: 5V; Output Voltage: 15V; Output Current: 133mA; Max Operating Temperature: 85°C; Pins: 4; RoHS Compliant: Yes; Min Operating Temperature: -40°C; Mounting Technology: TH; Case/Package: 4-SIP
U9 = CMP-171-000000-7: Fixed Positive LDO Regulator, 3.3V, 0.25V Dropout, PDSO5; Output Voltage1-Max: 3.366V; Number of Functions: 1; Input Voltage Absolute-Max: 6V; Dropout Voltage1-Nom: 120mV; MP: LP5907MFX-3.0/NOPB; Min Input Voltage: 2.2V; MF: Texas Instruments; Regulator Type: FIXED POSITIVE SINGLE OUTPUT LDO REGULATOR; Output Voltage1-Min: 3.234V; Package Equivalence Code: TSOP5/6,.11,37; Package Body Material: Plastic; Dropout Voltage1-Max: 250mV; Qualification Status: Not Qualified; Max Input Voltage: 5.5V; Voltage Tolerance-Max: 2%; Output Current1-Max: 250mA; Packaging: Tape and Reel; Reach SVHC Compliant: Yes; RoHS Compliant: Yes; Moisture Sensitivity Level: 1; Technology: CMOS; Component Type: Standard; SnapEDA_Link: https://www.snapeda.com/parts/LP5907MFX-3.0/NOPB/Texas%20Instruments/view-part/379728/?ref=snap; Source: LP5907MFX-3.0_NOPB.SchLib; Mouser-Purchase-URL: https://snapeda.com/shop?store=Mouser&id=379728; Value: *; Terminal Form: Gull Wing; Number of Outputs: 1; Number of Pins: 5; JESD-30 Code: R-PDSO-G5; Height - Seated (Max): 1.45mm; Availability: Unavailable; JESD-609 Code: e3; Arrow_Electronics-Purchase-URL: https://snapeda.com/shop?store=Arrow+Electronics&id=379728; Width: 1.6mm; Package Shape: Rectangular; Texas_Instruments-Purchase-URL: https://snapeda.com/shop?store=Texas+Instruments&id=379728; Peak Reflow Temperature (Cel): 260°C; Package Code: LSSOP; Pin Count: 5; Price: None; Package Style: SMALL OUTLINE, LOW PROFILE, SHRINK PITCHMeter; Terminal Finish: Tin; Output Voltage1-Nom: 3.3V; Adjustability: FIXED; Terminal Pitch: 0.95mm; Terminal Position: DUAL; DigiKey-Purchase-URL: https://snapeda.com/shop?store=DigiKey&id=379728; Operating Temperature, TJ-Min: -40°C; Surface Mount: Yes; Package: SOT-23-5 Texas Instruments; Length: 2.9mm; Operating Temperature, TJ-Max: 125°C; Design Item ID: LP5907MFX-3.0/NOPB

## Sheet hv_Isolation.SchDoc
size A; SheetNumber: 9; SheetTotal: 12
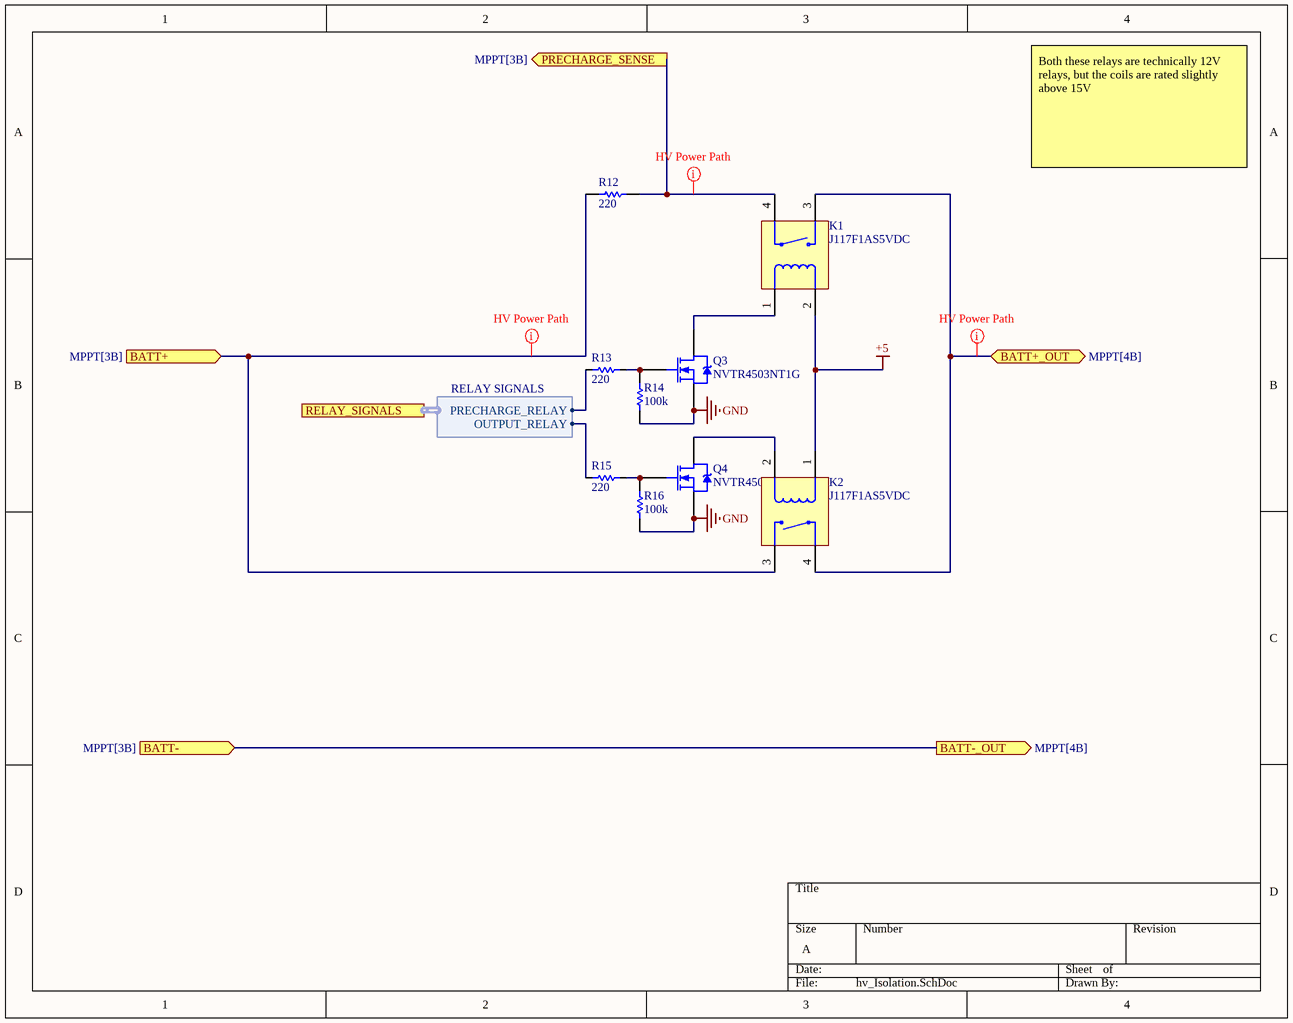
[diagram p8: hv_Isolation.SchDoc]

### Parts
K1  J117F1AS5VDC  [J117F1AS5VDC-Footprint]
K2  J117F1AS5VDC  [J117F1AS5VDC-Footprint]
Q3  NVTR4503NT1G  [SOT-23_N]
Q4  NVTR4503NT1G  [SOT-23_N]
R12  value 220  [R_Res_Axial_SQP_THRU]  (hidden comment: SQPW10220RJ)
R13  value 220  [0603_RESISTOR]  (hidden comment: R 0603 220 ohm 1%)
R14  value 100k  [RESC1608X55X25ML10T15]  (hidden comment: Resistor 100k +/-1% 0603 100 mW)
R15  value 220  [0603_RESISTOR]  (hidden comment: R 0603 220 ohm 1%)
R16  value 100k  [RESC1608X55X25ML10T15]  (hidden comment: Resistor 100k +/-1% 0603 100 mW)

### Ports
BATT+ (in, see MPPT[3B]), BATT+_OUT (bidir, see MPPT[4B]), BATT- (in, see MPPT[3B]), BATT-_OUT (out, see MPPT[4B]), PRECHARGE_SENSE (out, see MPPT[3B]), RELAY_SIGNALS (harness RELAY SIGNALS, see MPPT[3B], MicroController[2B])

### Harnesses
RELAY SIGNALS: OUTPUT_RELAY, PRECHARGE_RELAY

### Nets
+5: K1.2(CTRL-) K2.1(CTRL+)
GND: Q3.2(S) Q4.2(S) R14.1 R16.1 ; port BATT-_OUT, port BATT-
Bat+: K1.3(DC-) K2.4(DC+) ; port BATT+_OUT
NetF1_2: K2.3(DC-) R12.1 ; port BATT+
NetK1_1: K1.1(CTRL+) Q3.3(D)
NetK1_4: K1.4(DC+) R12.2 ; port PRECHARGE_SENSE
NetK2_2: K2.2(CTRL-) Q4.3(D)
NetQ3_1: Q3.1(G) R13.2 R14.2
NetQ4_1: Q4.1(G) R15.2 R16.2
NetR13_1: R13.1 ; port RELAY_SIGNALS.PRECHARGE_RELAY
NetR15_1: R15.1 ; port RELAY_SIGNALS.OUTPUT_RELAY

### Layout directives
net class High Current; net class HV: Bat+, NetF1_2, NetK1_4

### Notes on the sheet
- Both these relays are technically 12V relays, but the coils are rated slightly above 15V

### Library data of the parts
K1 K2 = CMP-008-00017-3: Relay Gen Purpose SPST 10A 5V; Operate Time: 10ms; Coil Voltage: 5; RoHS Compliant: yes; Pins: 4; Contact Form: SPST; Mounting Technology: TH; Max Operating Temperature: 125°C; Current Rating: 10A; Min Operating Temperature: -55°C
Q3 Q4 = CMP-062-000014-2: Small Signal Field-Effect Transistor, 1.5A I(D), 30V, 1-Element, N-Channel, Silicon, Metal-oxide Semiconductor FET, TO-236; Max Operating Temperature: 150°C; Case/Package: SOT23; PackageReference: SOT-23; Vgs(th) (Max) @ Id: 1.5A; RoHS Compliant: Yes; Pins: 3
R12 = Resistor     0016-2: Fixed Resistor, Wire Wound, 10W, 220ohm, 750V, 5% +/-Tol, 300ppm/Cel, Through Hole Mount; Tolerance: 5%; Case/Package: Axial; Pins: 2; RoHS Compliant: Yes; Mounting Technology: TH; Min Operating Temperature: -55°C; Power: 10W; Max Operating Temperature: 155°C
R13 R15 = CMP-058-000021-5: RES 220 OHM 1/16W 1% 0603 SMD; Power: 62.5mW; Case/Package: 0603; Tolerance: 1%; Mounting Technology: SMD; Pins: 2
R14 R16 = CMP-009-00023-8: Chip Resistor, 100 KOhm, +/- 1%, 0.1 W, -55 to 155 degC, 0603 (1608 Metric); Power: 100mW; Voltage Rating: 50V; Case/Package: 0603; RoHS Compliant: True; Mounting Technology: SMD; Min Operating Temperature: -55°C; Tolerance: 1%; Pins: 2; Max Operating Temperature: 155°C

## Sheet indicator_leds.SchDoc
size A; SheetNumber: 10; SheetTotal: 12
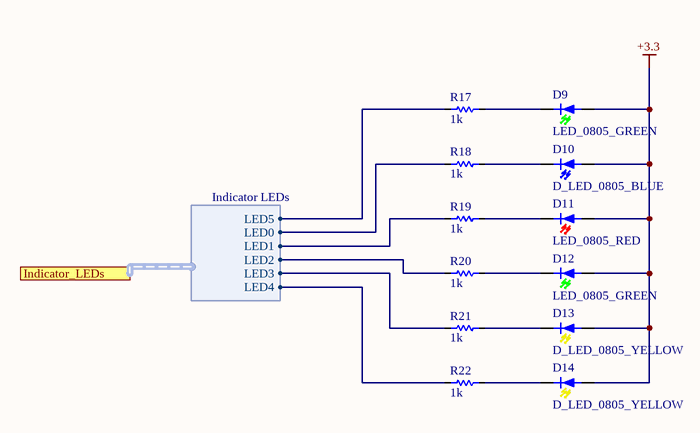
[diagram p9: indicator_leds.SchDoc]

### Parts
D9  LED_0805_GREEN  [0805_LED_Green]
D10  D_LED_0805_BLUE  [0805_LED_Blue]
D11  LED_0805_RED  [0805_LED_Red]
D12  LED_0805_GREEN  [0805_LED_Green]
D13  D_LED_0805_YELLOW  [0805_LED_Yellow]
D14  D_LED_0805_YELLOW  [0805_LED_Yellow]
R17  value 1k  [0603_RESISTOR]  (hidden comment: Res 0603 1K ohm 1%)
R18  value 1k  [0603_RESISTOR]  (hidden comment: Res 0603 1K ohm 1%)
R19  value 1k  [0603_RESISTOR]  (hidden comment: Res 0603 1K ohm 1%)
R20  value 1k  [0603_RESISTOR]  (hidden comment: Res 0603 1K ohm 1%)
R21  value 1k  [0603_RESISTOR]  (hidden comment: Res 0603 1K ohm 1%)
R22  value 1k  [0603_RESISTOR]  (hidden comment: Res 0603 1K ohm 1%)

### Ports
Indicator_LEDs (harness Indicator LEDs, see MPPT[3C], MicroController[5B])

### Harnesses
Indicator LEDs: LED0, LED1, LED2, LED3, LED4, LED5

### Nets
+3.3: D9.1(Anode) D10.1(Anode) D11.1(Anode) D12.1(Anode) D13.1(Anode) D14.1(Anode)
IND0: R18.1 ; port Indicator_LEDs.LED0
IND1: R19.1 ; port Indicator_LEDs.LED1
IND2: R20.1 ; port Indicator_LEDs.LED2
IND3: R21.1 ; port Indicator_LEDs.LED3
IND4: R22.1 ; port Indicator_LEDs.LED4
IND5: R17.1 ; port Indicator_LEDs.LED5
NetD9_2: D9.2(Cathode) R17.2
NetD10_2: D10.2(Cathode) R18.2
NetD11_2: D11.2(Cathode) R19.2
NetD12_2: D12.2(Cathode) R20.2
NetD13_2: D13.2(Cathode) R21.2
NetD14_2: D14.2(Cathode) R22.2

### Library data of the parts
D9 D12 = CMP-151-000025-2: LED CHIPLED 570NM GREEN 0805 SMD; Manufacturer PN: LG R971-KN-1-0-20-R18; Manufacturer: Osram Opto Semiconductors Inc; Current: 20mA; Forward Voltage: 2.2V; SVP Creator: Nate Bolyard; Source: diode.SchLib; Package: 0805; Value: GREEN; Supplier PN: 475-1410-1-ND; Design Item ID: D_LED_0805_GREEN
D10 = CMP-151-000020-1: LED 2X1.2MM 470NM BL WTR CLR SMD; Manufacturer PN: APT2012QBC/D; Manufacturer: Kingbright; Forward Voltage: 3.3; SVP Creator: Jonathan Nutzmann; Value: BLUE; Current: 20mA; Design Item ID: D_LED_0805_BLUE; Source: diode.SchLib; Supplier PN: 754-1437-1-ND; Package: 0805
D11 = CMP-151-000016-5: LED CHIPLED 645NM RED DIFF 0805; Manufacturer: OSRAM Opto Semiconductors Inc; Manufacturer PN: LH R974-LP-1; SVP Creator: Jonathan Nutzmann; Forward Voltage: 1.8V; Current: 20mA; Package: 0805; Value: RED; Source: diode.SchLib; Design Item ID: D_LED_0805_RED
D13 D14 = CMP-151-000028-1: LED 595NM AMBER DIFF SMD 0805; Manufacturer PN: HSMA-C170; Manufacturer: Avago Technologies US Inc.; Forward Voltage: 1.9; Current: 20mA; SVP Creator: Jonathan Nutzmann; Source: diode.SchLib; Package: 0805; Supplier PN: 516-1431-1-ND; Value: Amber; Design Item ID: D_LED_0805_YELLOW
R17-R22 = CMP-058-000005-5: as R5 on sheet MicroController; Case/Package: 0603; Mounting Technology: SMD; Pins: 2; Tolerance: 1%

## Sheet temp_measure.SchDoc
size A; SheetNumber: 11; SheetTotal: 12
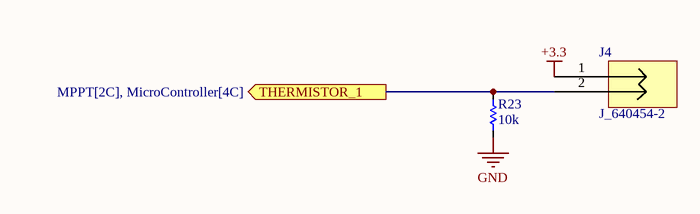
[diagram p10: temp_measure.SchDoc]

### Parts
J4  J_640454-2  [640454-2]
R23  value 10k  [0603_RESISTOR]  (hidden comment: Res 0603 10K ohm 1%)

### Ports
THERMISTOR_1 (out, see MPPT[2C], MicroController[4C])

### Nets
+3.3: J4.1
GND: R23.1
NetJ4_2: J4.2 R23.2 ; port THERMISTOR_1

### Library data of the parts
J4 = CMP-009-000000-4: 2 Positions Header, Unshrouded Connector 0.100" (2.54mm) Through Hole Tin; Max Current Rating: 2A; Gender: Male; Pins: 2; Mounting Technology: TH
R23 = CMP-058-000017-6: RES 10K OHM 1/16W 1% 0603 SMD; Power: 62.5mW; Pins: 2; Case/Package: 0603; Tolerance: 1%; Mounting Technology: SMD

## Sheet UART.SchDoc
size A; SheetNumber: 12; SheetTotal: 12
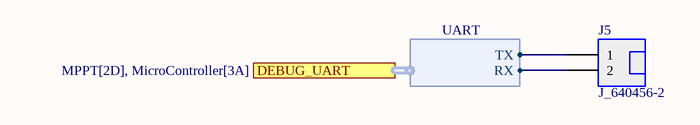
[diagram p11: UART.SchDoc]

### Parts
J5  J_640456-2  [J_640456-2]

### Ports
DEBUG_UART (harness UART, see MPPT[2D], MicroController[3A])

### Harnesses
UART: TX, RX

### Nets
NetJ5_1: J5.1 ; port DEBUG_UART.TX
NetJ5_2: J5.2 ; port DEBUG_UART.RX

### Library data of the parts
J5 = CMP-002-00087-1: Connector Header Through Hole 2 position 0.100" (2.54mm); Manufacturer: TE Connectivity; Voltage Rating: 250V; Contact Resistance: 6mR; Current Rating: 5A; Manufacturer Part Number: 640456-2; Design Item ID: J_640456-2; Source: connector.SchLib; Max Operating Temperature: 221°C; Min Operating Temperature: -67°C

## Nets that join several sheets
+3.3: GateDriver (U1.1 U2.1), Power (C3.2 U3.8), MicroController (18 pins), JTAG (C32.2 J3.1), CanTrans (C33.2 U5.1), LVRegulation (C40.2 U9.5), indicator_leds (6 pins), temp_measure (J4.1)
+5: LVRegulation (7 pins), hv_Isolation (K1.2 K2.1)
+5 Car: CanTrans (C34.1 U5.16), LVRegulation (U6.3)
+15: GateDriver (C1.2 C2.2 U1.8 U2.8), LVRegulation (C39.2 U8.4)
+24: MPPT (J1.7 J1.12), LVRegulation (F3.2)
CAR_GND: MPPT (J1.8 J1.11), CanTrans (5 pins), LVRegulation (C36.1 U6.2 U7.2 U7.3)
GND: MPPT (J2.2 J2.4), GateDriver (12 pins), Power (19 pins), MicroController (26 pins), JTAG (6 pins), CanTrans (C33.1 U5.2 U5.7 U5.8), Array Scaling (C35A.1 R11A.1), Battery Scaling (C35B.1 R11B.1), LVRegulation (9 pins), hv_Isolation (Q3.2 Q4.2 R14.1 R16.1), temp_measure (R23.1), PreCharge Scalaing (C35C.1 R11C.1)
Array+: MPPT (J2.3), Power (F2.1)
Array_Measure: Power (F2.2 U3.1 U3.2), Array Scaling (R10A.2)
AUX_SIDE_GATE: GateDriver (D1.2 R1.2 TP4.1 U1.6), Power (Q1.1)
Bat+: MPPT (J2.1), hv_Isolation (K1.3 K2.4)
boost_output: Power (9 pins), Battery Scaling (R10B.2)
CAN_N: MPPT (J1.2 J1.6), CanTrans (D8.1 U5.12)
CAN_P: MPPT (J1.1 J1.5), CanTrans (D8.2 U5.13)
CAN_RX: MicroController (U4.82), CanTrans (R8.1)
CAN_TX: MicroController (U4.83), CanTrans (R9.1)
GATE_HIGH: GateDriver (U1.2), MicroController (TP7.1 U4.79)
GATE_LOW: GateDriver (U2.2), MicroController (TP8.1 U4.93)
HAL_OUTPUT: Power (TP6.1 U3.7), MicroController (R5.1 R7.1)
IND0: MicroController (U4.70), indicator_leds (R18.1)
IND1: MicroController (U4.69), indicator_leds (R19.1)
IND2: MicroController (U4.68), indicator_leds (R20.1)
IND3: MicroController (U4.67), indicator_leds (R21.1)
IND4: MicroController (U4.66), indicator_leds (R22.1)
IND5: MicroController (U4.65), indicator_leds (R17.1)
JTCK: MicroController (U4.77), JTAG (D7.1 J3.4)
JTDI: MicroController (U4.78), JTAG (D7.4 J3.8)
JTDO: MicroController (U4.90), JTAG (D7.6 J3.6)
JTMS: MicroController (U4.76), JTAG (D7.3 J3.2)
LOW_SIDE_GATE: GateDriver (D3.2 R3.2 TP3.1 U2.6), Power (Q2.1)
NetC35A_2: MicroController (U4.32), Array Scaling (C35A.2 R10A.1 R11A.2)
NetC35B_2: MicroController (U4.25), Battery Scaling (C35B.2 R10B.1 R11B.2)
NetC35C_2: MicroController (U4.50), PreCharge Scalaing (C35C.2 R10C.1 R11C.2)
NetF1_2: Power (F1.2), hv_Isolation (K2.3 R12.1)
NetJ4_2: MicroController (U4.41), temp_measure (J4.2 R23.2)
NetJ5_1: MicroController (U4.97), UART (J5.1)
NetJ5_2: MicroController (U4.98), UART (J5.2)
NetK1_4: hv_Isolation (K1.4 R12.2), PreCharge Scalaing (R10C.2)
NetR13_1: MicroController (U4.16), hv_Isolation (R13.1)
NetR15_1: MicroController (U4.17), hv_Isolation (R15.1)